# Altium schematic sheet kinkan.SchDoc
size A4; SheetNumber: 7; SheetTotal: 7
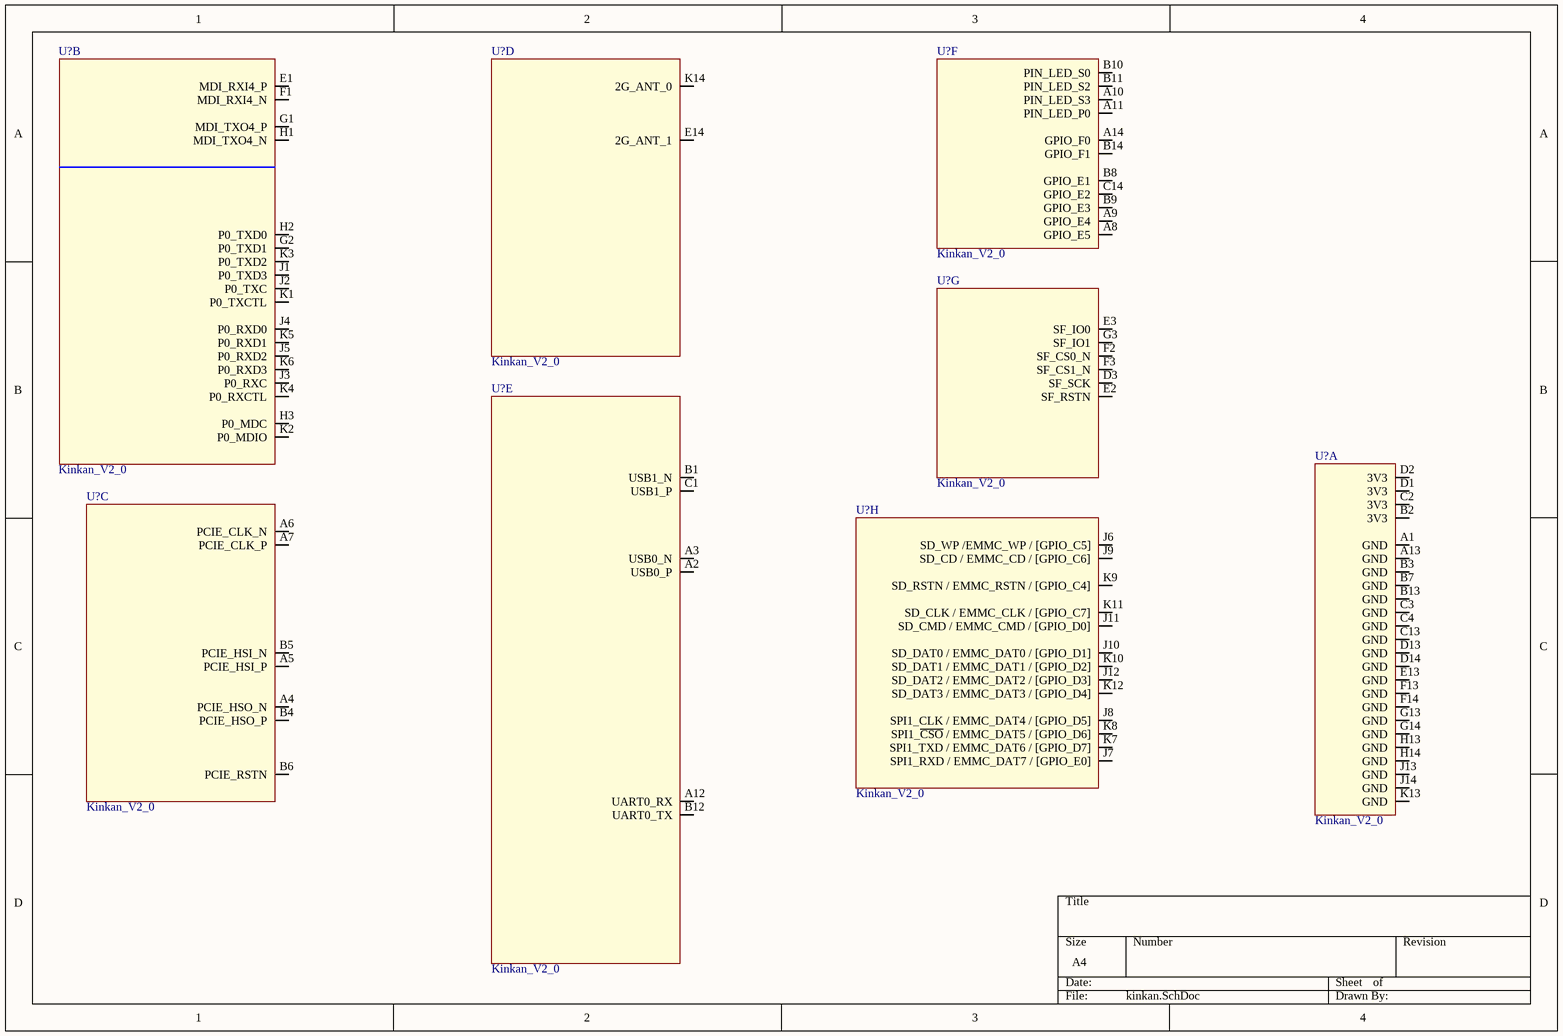
[diagram p0: kinkan.SchDoc]

## Parts
(Parts that share a designator on the sheet are numbered #1, #2 ... from top to bottom, then left to right.)
U?#1  Kinkan_V2_0  [Kinkan_V2.0]  (part B of 8)
U?#2  Kinkan_V2_0  [Kinkan_V2.0]  (part D of 8)
U?#3  Kinkan_V2_0  [Kinkan_V2.0]  (part F of 8)
U?#4  Kinkan_V2_0  [Kinkan_V2.0]  (part G of 8)
U?#5  Kinkan_V2_0  [Kinkan_V2.0]  (part E of 8)
U?#6  Kinkan_V2_0  [Kinkan_V2.0]  (part C of 8)
U?#7  Kinkan_V2_0  [Kinkan_V2.0]  (part H of 8)
U?#8  Kinkan_V2_0  [Kinkan_V2.0]  (part A of 8)

## Nets

Not connected (* = marked no-connect by the designer): U?#1 E1(MDI_RXI4_P) F1(MDI_RXI4_N) G1(MDI_TXO4_P) G2(P0_TXD1) H1(MDI_TXO4_N) H2(P0_TXD0) H3(P0_MDC) J1(P0_TXD3) J2(P0_TXC) J3(P0_RXC) J4(P0_RXD0) J5(P0_RXD2) K1(P0_TXCTL) K2(P0_MDIO) K3(P0_TXD2) K4(P0_RXCTL) K5(P0_RXD1) K6(P0_RXD3); U?#2 E14(2G_ANT_1) K14(2G_ANT_0); U?#3 A8(GPIO_E5) A9(GPIO_E4) A10(PIN_LED_S3) A11(PIN_LED_P0) A14(GPIO_F0) B8(GPIO_E1) B9(GPIO_E3) B10(PIN_LED_S0) B11(PIN_LED_S2) B14(GPIO_F1) C14(GPIO_E2); U?#4 D3(SF_SCK) E2(SF_RSTN) E3(SF_IO0) F2(SF_CS0_N) F3(SF_CS1_N) G3(SF_IO1); U?#5 A2(USB0_P) A3(USB0_N) A12(UART0_RX) B1(USB1_N) B12(UART0_TX) C1(USB1_P); U?#6 A4(PCIE_HSO_N) A5(PCIE_HSI_P) A6(PCIE_CLK_N) A7(PCIE_CLK_P) B4(PCIE_HSO_P) B5(PCIE_HSI_N) B6(PCIE_RSTN); U?#7 J6(SD_WP_/EMMC_WP_/_[GPIO_C5]) J7(SPI1_RXD_/_EMMC_DAT7_/_[GPIO_E0]) J8(SPI1_CLK_/_EMMC_DAT4_/_[GPIO_D5]) J9(SD_CD_/_EMMC_CD_/_[GPIO_C6]) J10(SD_DAT0_/_EMMC_DAT0_/_[GPIO_D1]) J11(SD_CMD_/_EMMC_CMD_/_[GPIO_D0]) J12(SD_DAT2_/_EMMC_DAT2_/_[GPIO_D3]) K7(SPI1_TXD_/_EMMC_DAT6_/_[GPIO_D7]) K8(SPI1_~{CSO}_/_EMMC_DAT5_/_[GPIO_D6]) K9(SD_RSTN_/_EMMC_RSTN_/_[GPIO_C4]) K10(SD_DAT1_/_EMMC_DAT1_/_[GPIO_D2]) K11(SD_CLK_/_EMMC_CLK_/_[GPIO_C7]) K12(SD_DAT3_/_EMMC_DAT3_/_[GPIO_D4]); U?#8 A1(GND) A13(GND) B2(3V3) B3(GND) B7(GND) B13(GND) C2(3V3) C3(GND) C4(GND) C13(GND) D1(3V3) D2(3V3) D13(GND) D14(GND) E13(GND) F13(GND) F14(GND) G13(GND) G14(GND) H13(GND) H14(GND) J13(GND) J14(GND) K13(GND)

## Library data of the parts
U?#1-U?#8 = Kinkan_V2_0: ICLN: MOD_KINKAN_V2_A001